# Altium schematic sheet Cover_Page.SchDoc: Arduino Shield
size A4; DocumentNumber: SCH-ARD-SHIELD; Revision: A; SheetNumber: 1; SheetTotal: 3
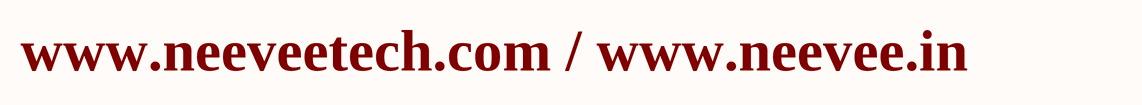
[diagram p0: Cover_Page.SchDoc]

## Notes on the sheet
- www.neeveetech.com / www.neevee.in
- Title
- Size:
- A4
- Number:
- Revision:
- Date:
- Time:
- Sheet
- of